# Altium schematic sheet AUX_M8_CONN_PWR_IN.SchDoc
size Tabloid; SheetNumber: 17; SheetTotal: 17
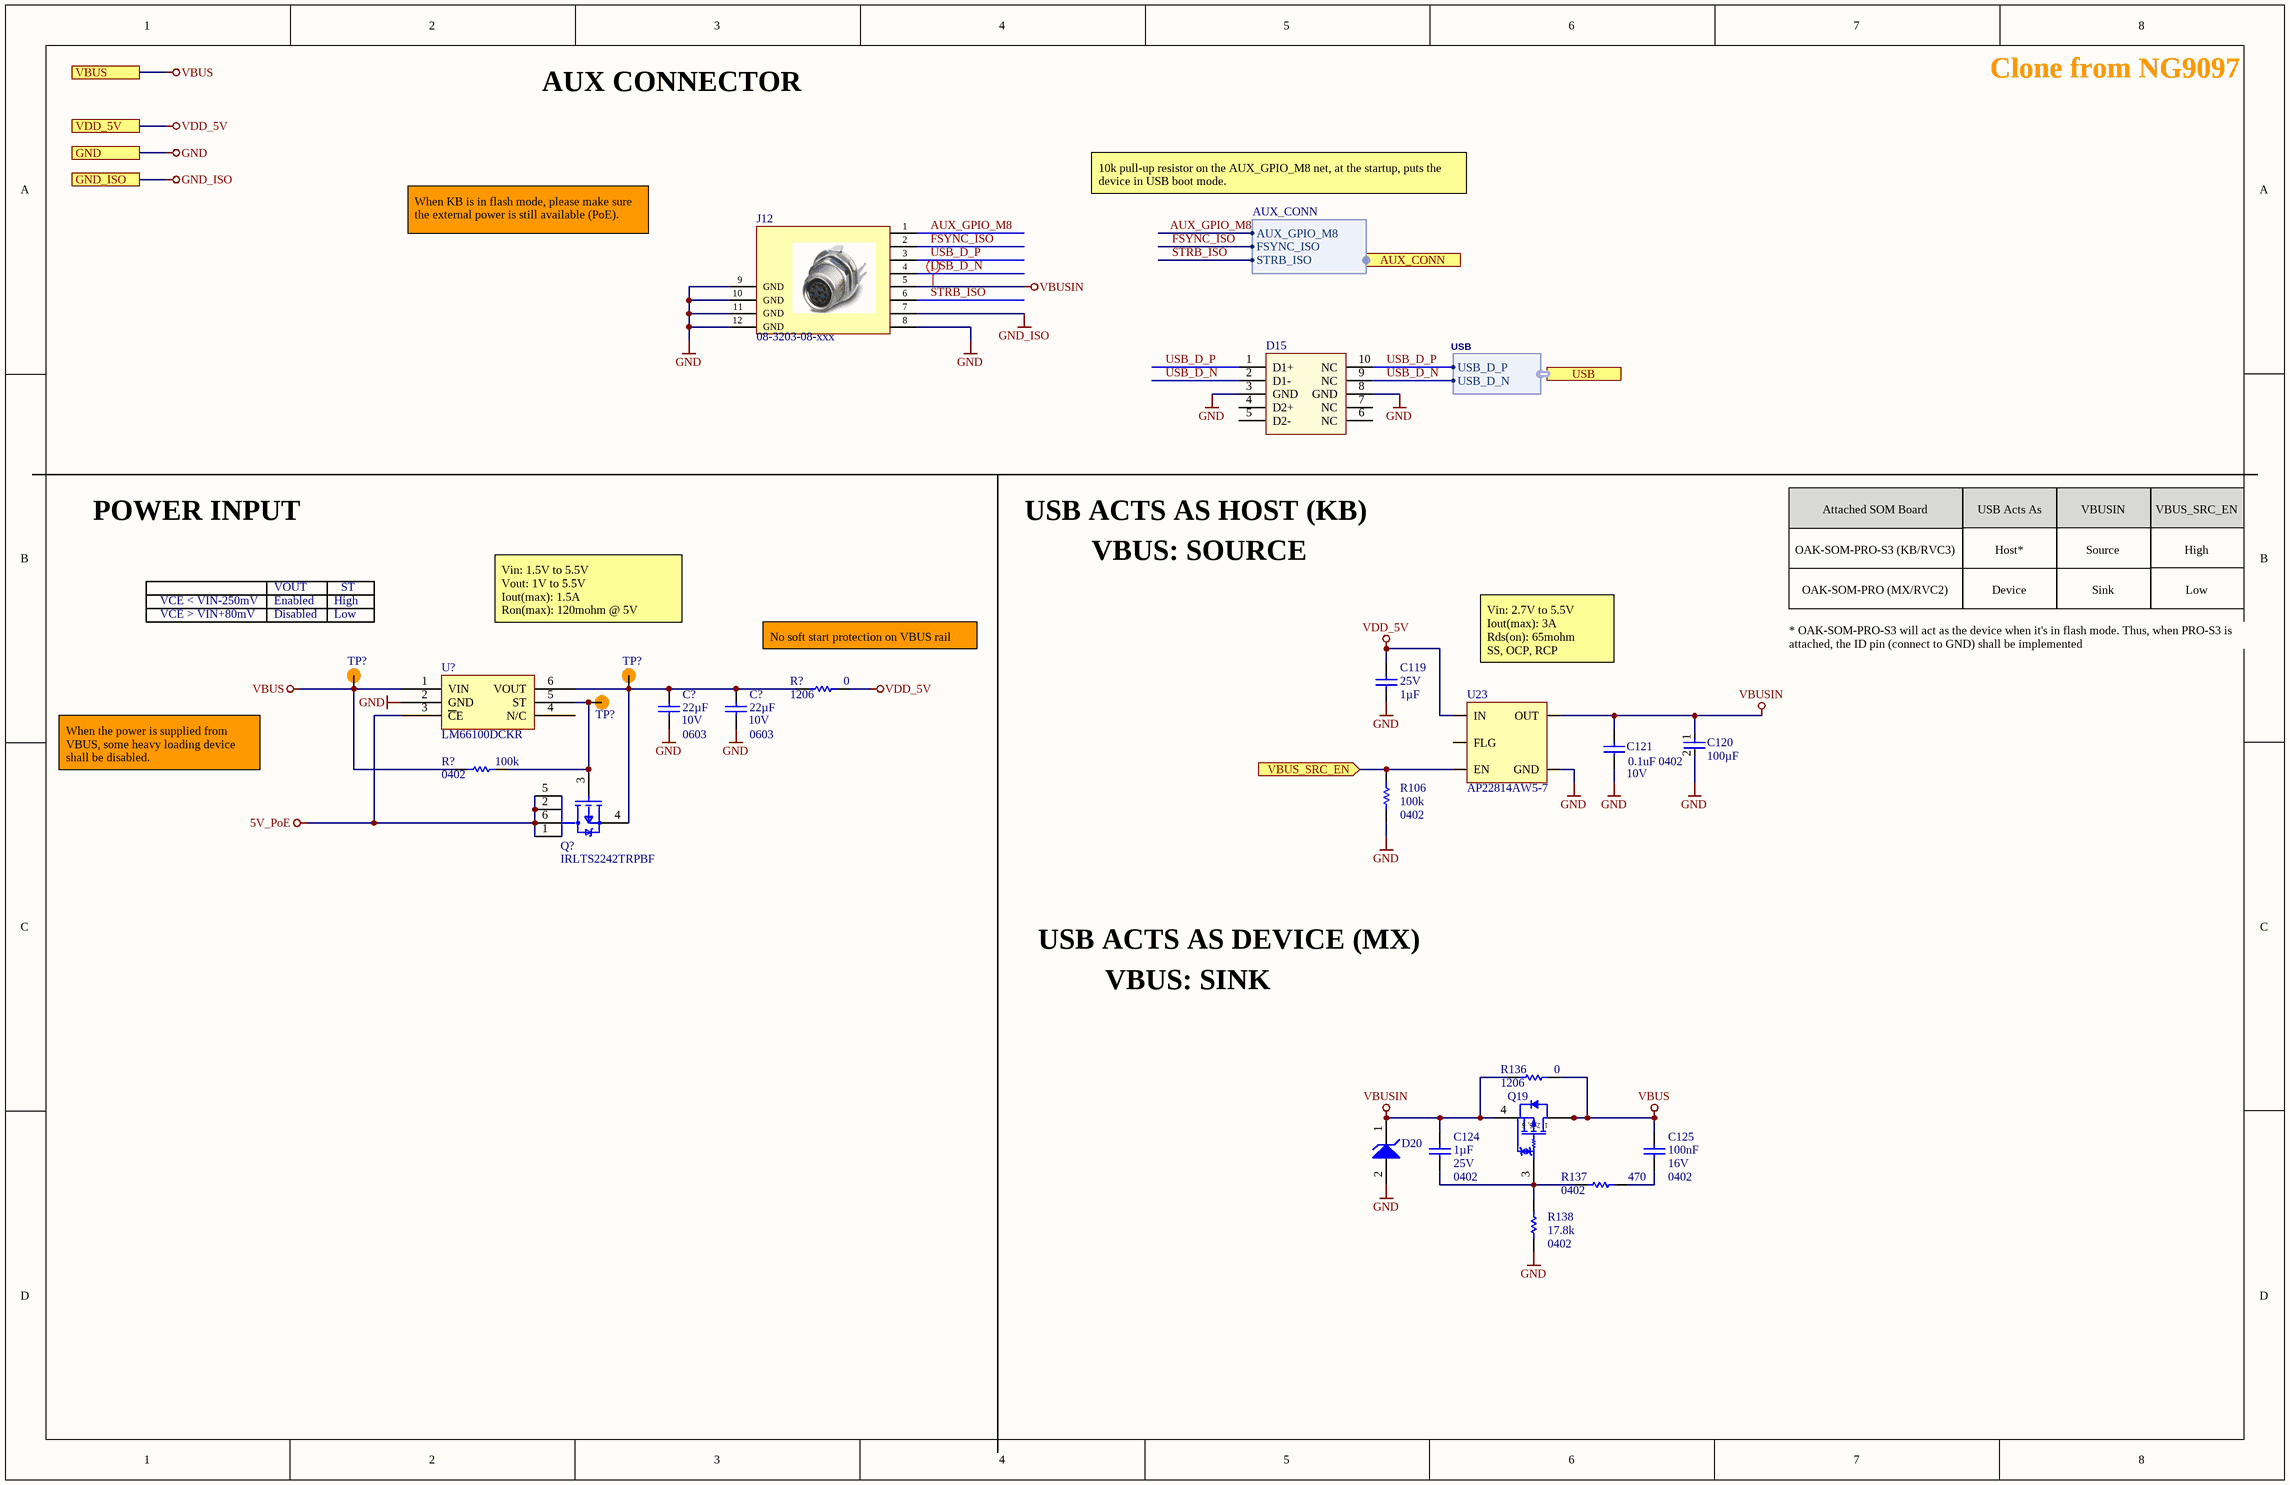
[diagram p0: AUX_M8_CONN_PWR_IN.SchDoc]

## Parts
(Parts that share a designator on the sheet are numbered #1, #2 ... from top to bottom, then left to right.)
C119  value 1µF  Voltage Rating: 25V  [CAPC0402(1005)70_N]  (hidden comment: GRM155R61E105KA12D)
C120  value 100µF  [FP-C1210C107M8PACTU-MFG]  (hidden comment: C1210C107M8PACTU)
C121  0.1uF 0402  Voltage Rating: 10V  [CAPC0402(1005)70_N]
C124  value 1µF  Voltage Rating: 25V  Case/Package: 0402  [CAPC0402(1005)70_N]  (hidden comment: GRM155R61E105KA12D)
C125  value 100nF  Voltage Rating: 16V  Case/Package: 0402  [CAPC0402(1005)60_N]  (hidden comment: CL05B104KO5NFNC)
C?#1  value 22µF  Voltage Rating: 10V  Case/Package: 0603  [CAPC0603(1608)100_N]  (hidden comment: GRM188R61A226ME15D)
C?#2  value 22µF  Voltage Rating: 10V  Case/Package: 0603  [CAPC0603(1608)100_N]  (hidden comment: GRM188R61A226ME15D)
D15  TPD4EUSB30DQAR  [TPD4EUSB30DQAR]  (value not drawn)
D20  SD05-01FTG  [FP-CDSOD323-TxxS-MFG]  (value not drawn)
J12  08-3203-08-xxx  [08-3203-08-XXX]
Q19  NTJS4151PT1G  [ONSC-SC70-6-419B-02_W_V]  (value not drawn)
Q?  IRLTS2242TRPBF  [TSOP-6-MFG]
R106  value 100k  Case/Package: 0402  [RESC0402(1005)_L]  (hidden comment: RC0402FR-07100KL)
R136  value 0  Case/Package: 1206  [RESC3116X70X50ML13T20]  (hidden comment: Resistor 0R +/- 0.05% 1206 250 mW)
R137  value 470  Case/Package: 0402  [RESC0402(1005)_L]  (hidden comment: CRCW0402470RFKED)
R138  value 17.8k  Case/Package: 0402  [RESC0402(1005)_L]  (hidden comment: ERJ-2RKF1782X)
R?#1  value 0  Case/Package: 1206  [RESC3116X70X50ML13T20]  (hidden comment: Resistor 0R +/- 0.05% 1206 250 mW)
R?#2  value 100k  Case/Package: 0402  [RESC0402(1005)_L]  (hidden comment: RC0402FR-07100KL)
TP?#1  TEST_POINT  [TP075_150_NS]  (value not drawn)  (no BOM)
TP?#2  TEST_POINT  [TP075_150_NS]  (value not drawn)  (no BOM)
TP?#3  TEST_POINT  [TP075_150_NS]  (value not drawn)  (no BOM)
U23  AP22814AW5-7  [AP22814AW5-7-Footprint-1]
U?  LM66100DCKR  [LM66100DCKR]

## Ports
AUX_CONN (harness AUX_CONN), GND, GND_ISO, USB (harness USB), VBUS, VBUS_SRC_EN (in), VDD_5V

## Harnesses
AUX_CONN: AUX_GPIO_M8, FSYNC_ISO, STRB_ISO
USB: USB_D_P, USB_D_N

## Nets
5V_PoE: Q?.1(D) Q?.2(D) Q?.5(D) Q?.6(D) U?.3(~{C}E)
GND: C119.1 C120.2 C121.1 C?#1.1 C?#2.1 D15.3(GND) D15.8(GND) D20.2(A) J12.8 J12.9(GND) J12.10(GND) J12.11(GND) J12.12(GND) R106.2 R138.1 U23.2(GND) U?.2(GND) ; port GND
GND_ISO: J12.7 ; port GND_ISO
VBUS: C125.2 Q19.1(D) Q19.2(D) Q19.5(D) Q19.6(D) R136.2 R?#2.2 TP?#1.1 U?.1(VIN) ; port VBUS
VBUSIN: C120.1 C121.2 C124.2 D20.1(K) J12.5 Q19.4(S) R136.1 U23.1(OUT)
VDD_5V: C119.2 R?#1.2 U23.5(IN) ; port VDD_5V
AUX_GPIO_M8: J12.1 ; port AUX_CONN.AUX_GPIO_M8
FSYNC_ISO: J12.2 ; port AUX_CONN.FSYNC_ISO
STRB_ISO: J12.6 ; port AUX_CONN.STRB_ISO
USB_D_N: D15.2(D1-) D15.9(NC) J12.4 ; port USB.USB_D_N
USB_D_P: D15.1(D1+) D15.10(NC) J12.3 ; port USB.USB_D_P
VBUS_SRC_EN: R106.1 U23.4(EN) ; port VBUS_SRC_EN
NetC124_1: C124.1 Q19.3(G) R137.1 R138.2
NetC125_1: C125.1 R137.2
NetC?#1_2: C?#1.2 C?#2.2 Q?.4(S) R?#1.1 TP?#2.1 U?.6(VOUT)
NetQ?_3: Q?.3(G) R?#2.1 TP?#3.1 U?.5(ST)

Not connected (* = marked no-connect by the designer): D15 4(D2+) 5(D2-) 6(NC) 7(NC); U23 3(FLG); U? 4(N/C)

## Layout directives
net class Power_trace: VBUSIN

## Notes on the sheet
- AUX CONNECTOR
- Clone from NG9097
- When KB is in flash mode, please make sure the external power is still available (PoE).
- 10k pull-up resistor on the AUX_GPIO_M8 net, at the startup, puts the device in USB boot mode.
- POWER INPUT
- USB ACTS AS HOST (KB)
- VBUS: SOURCE
- OAK-SOM-PRO-S3 (KB/RVC3)
- Attached SOM Board
- USB Acts As
- Host*
- VBUSIN
- Source
- VBUS_SRC_EN
- High
- VCE < VIN-250mV
- VCE > VIN+80mV
- Enabled
- Disabled
- VOUT
- Low
- ST
- Vin: 1.5V to 5.5V
  Vout: 1V to 5.5V
  Iout(max): 1.5A
  Ron(max): 120mohm @ 5V
- OAK-SOM-PRO (MX/RVC2)
- Device
- Sink
- No soft start protection on VBUS rail
- Vin: 2.7V to 5.5V
  Iout(max): 3A
  Rds(on): 65mohm
  SS, OCP, RCP
- * OAK-SOM-PRO-S3 will act as the device when it's in flash mode. Thus, when PRO-S3 is attached, the ID pin (connect to GND) shall be implemented
- When the power is supplied from VBUS, some heavy loading device shall be disabled.
- USB ACTS AS DEVICE (MX)
- VBUS: SINK
- Title
- Size:
- Date:
- A4
- Number:
- Time:
- Revision:
- Sheet
- of
- Luxonis Holding Corporation
- 7901 Shaffer Pkwy
- Littleton, CO
- 80127 USA
- File:
- (in symbol CMP-061-000004-1) 1, 2, 5, 6

## Library data of the parts
C119 C124 = CMP-108-000014-2: CAP CER 1UF 25V X5R 0402 10%; Manufacturer 1: Murata; ComponentLink2Description: https://datasheet.ciiva.com/7719/1666664-7719006.pdf?src-supplier=Element14; ComponentLink2URL: https://datasheet.ciiva.com/7719/1666664-7719006.pdf?src-supplier=Element14; Max Operating Temperature: 85°C; Depth: 0.5mm; Mounting Technology: SMT; ComponentLink1URL: https://datasheet.ciiva.com/22732/1666664-22732122.pdf?src-supplier=Element14; Length: 1mm; ComponentLink1Description: https://datasheet.ciiva.com/22732/1666664-22732122.pdf?src-supplier=Element14; Manufacturer Part Number 1: GRM155R61E105KA12D; Tolerance: 10%; Design Item ID: GRM155R61E105KA12D; Dielectric: X5R; Min Operating Temperature: -55°C; Height: 0.5mm; Width: 0.5mm
  C119: Case/Package: 0402
C120 = CMP-001-00121-2: Ceramic Capacitor, Multilayer, Ceramic, 10V, 20% +Tol, 20% -Tol, X5R, 15% TC, 100uF, Surface Mount, 1210; Manufacturer 1: Kemet; Manufacturer Part Number 1: C1210C107M8PACTU; Capacitor Type: Ceramic; Dielectric: X5R; Min Operating Temperature: -55°C; Case/Package: 1210; Voltage Rating: 10V; Max Operating Temperature: 85°C
C121 = GRM155R71A104JA01D: CAP CER 0.1UF 10V X7R 0402 5%; Manufacturer 1: Murata; Capacitance: 100nF; Supplier 1: Digi-Key; Manufacturer Part Number 1: GRM155R71A104JA01D; Stock 1: 1346709; Pricing 1: 1=0.10000, 10=0.02500, 100=0.01130, 500=0.00806, 1000=0.00633, 2500=0.00575, 5000=0.00529 (USD); RoHS: Yes; Mount: Surface Mount; Case/Package: 0402; Case Code (Imperial): 0402; Case Code (Metric): 1005; Min Operating Temperature: -55°C; Max Operating Temperature: 125°C; Tolerance: 5%; Packaging: Tape and Reel; Voltage Rating (DC): 10V; Dielectric: X7R; Package Quantity: 10000; Termination: SMD/SMT; Length: 1mm; Height: 0.5mm; Width: 0.02inch; Thickness: 0.022inch; Depth: 0.5mm; Radiation Hardening: No; Lead Free: Lead Free; ComponentLink1URL: https://datasheet.ciiva.com/5411/product-5411135.pdf?src-supplier=Mouser; ComponentLink1Description: https://datasheet.ciiva.com/5411/product-5411135.pdf?src-supplier=Mouser; ComponentLink2URL: https://datasheet.ciiva.com/11618/c02e-11618821.pdf?src-supplier=Avnet; ComponentLink2Description: https://datasheet.ciiva.com/11618/c02e-11618821.pdf?src-supplier=Avnet; Supplier Part Number 1: 490-10777-1-ND
C125 = CMP-108-000002-2: CAP CER 0.1UF 16V X7R 0402; Manufacturer 1: Samsung; Tolerance: 10%; ComponentLink1URL: https://datasheet.ciiva.com/25767/cl05b104ko5nfnc-25767124.pdf?src-supplier=Digi-Key; Length: 1mm; Design Item ID: CL05B104KO5NFNC; Min Operating Temperature: -55°C; Width: 0.02inch; Dielectric: X7R; ComponentLink1Description: https://datasheet.ciiva.com/25767/cl05b104ko5nfnc-25767124.pdf?src-supplier=Digi-Key; Height: 0.5mm; Depth: 0.5mm; Manufacturer Part Number 1: CL05B104KO5NFNC; Max Operating Temperature: 125°C; Mounting Technology: SMT
C?#1 C?#2 = CMP-108-000020-2: CAP CER 22UF 10V X5R 0603 20%; Manufacturer 1: Murata; Tolerance: 20%; Max Operating Temperature: 85°C; ComponentLink1Description: https://datasheet.ciiva.com/46444/1769893-46444975.pdf?src-supplier=Element14; Min Operating Temperature: -55°C; Manufacturer Part Number 1: GRM188R61A226ME15D; Mounting Technology: SMT; Depth: 0.8mm; Design Item ID: GRM188R61A226ME15D; Height: 0.8mm; Dielectric: X5R; Width: 0.8mm; Length: 1.6mm; ComponentLink1URL: https://datasheet.ciiva.com/46444/1769893-46444975.pdf?src-supplier=Element14
D15 = CMP-008-000011-2: TVS DIODE 5.5V 8V 10SON 8V Clamp 1A (8/20µs) Ipp Tvs Diode Surface Mount 10-USON (2.5x1); Manufacturer 1: Texas Instruments; Forward Current: 5A; Manufacturer Part Number 1: TPD4EUSB30DQAR; Min Operating Temperature: -40°C; Max Operating Temperature: 85°C; Clamping Voltage: 8V
D20 = SD05-01FTG: Trans Voltage Suppressor Diode, 450W, 5V V(RWM), Unidirectional, 1 Element, Silicon; Manufacturer 1: Littelfuse; Package Body Material: Plastic; Number of Elements: 1; Time @ Peak Reflow Temperature-Max (s): 40s; Supplier 1: Digi-Key; RoHS: Yes; Category: TVS Diodes; Number of Pins: 2; Diode Element Material: SILICON; Package Shape: Rectangular; Terminal Finish: Tin; Min Operating Temperature: -40°C; Max Operating Temperature: 125°C; JESD-609 Code: e3; Polarity: Unidirectional; Diode Type: TRANS VOLTAGE SUPPRESSOR; JESD-30 Code: R-PDSO-G2; Non-rep Peak Rev Power Dis-Max: 450W; Package Style: SMALL OUTLINEMeter; Peak Reflow Temperature (Cel): 260°C; Rep Pk Reverse Voltage-Max: 5V; Surface Mount: Yes; Technology: AVALANCHE; Terminal Form: Gull Wing; Terminal Position: DUAL; REACH SVHC: No SVHC; RoHS Compliant: Yes; ComponentLink1URL: https://datasheet.ciiva.com:443/pdfs/VipMasterIC/IC/LFSI/LFSI-S-A0009026845/LFSI-S-A0009026845-1.pdf?src-supplier=IHS+Markit; ComponentLink1Description: https://datasheet.ciiva.com:443/pdfs/VipMasterIC/IC/LFSI/LFSI-S-A0009026845/LFSI-S-A0009026845-1.pdf?src-supplier=IHS+Markit; ComponentLink2URL: https://datasheet.ciiva.com/13083/littelfuse-tvs-diode-array-sd05-13083440.pdf?src-supplier=Mouser; ComponentLink2Description: https://datasheet.ciiva.com/13083/littelfuse-tvs-diode-array-sd05-13083440.pdf?src-supplier=Mouser; ComponentLink3URL: https://datasheet.ciiva.com/22643/littelfuse-tvs-diode-array-sd05-datasheet-22643616.pdf?src-supplier=Element14; ComponentLink3Description: https://datasheet.ciiva.com/22643/littelfuse-tvs-diode-array-sd05-datasheet-22643616.pdf?src-supplier=Element14; ComponentLink4URL: https://datasheet.ciiva.com/18551/littelfuse-tvs-diode-array-sd05-datasheet-18551556.pdf?src-supplier=Digi-Key; ComponentLink4Description: https://datasheet.ciiva.com/18551/littelfuse-tvs-diode-array-sd05-datasheet-18551556.pdf?src-supplier=Digi-Key; ComponentLink5URL: https://datasheet.ciiva.com/18551/littelfuse-tvs-diode-array-sd-datasheet-pdf-18551557.pdf?src-supplier=Digi-Key; ComponentLink5Description: https://datasheet.ciiva.com/18551/littelfuse-tvs-diode-array-sd-datasheet-pdf-18551557.pdf?src-supplier=Digi-Key; ComponentLink6URL: https://datasheet.ciiva.com/18551/littelfuse-tvs-diode-array-sd-datasheet-pdf-18551558.pdf?src-supplier=Digi-Key; ComponentLink6Description: https://datasheet.ciiva.com/18551/littelfuse-tvs-diode-array-sd-datasheet-pdf-18551558.pdf?src-supplier=Digi-Key; Supplier Part Number 1: F6190CT-ND; Manufacturer Part Number 1: SD05-01FTG; Stock 1: 9404; Pricing 1: 1=0,43000, 10=0,35200, 100=0,23940, 500=0,17952, 1000=0,13464 (USD)
J12 = CMP-002-00116-2: M8 Circular Connector; Manufacturer 1: KingTop; RoHS: Yes; Category: Circular Connectors; Contact Finish - Mating: NOT SPECIFIED; Connector Type: Circular; REACH SVHC: No SVHC; RoHS Compliant: Yes; ComponentLink1URL: https://datasheet.ciiva.com:443/pdfs/VipMasterIC/IC/PCON/PCON-S-A0001961096/PCON-S-A0001960825-1.pdf?src-supplier=IHS+Markit; ComponentLink1Description: https://datasheet.ciiva.com:443/pdfs/VipMasterIC/IC/PCON/PCON-S-A0001961096/PCON-S-A0001960825-1.pdf?src-supplier=IHS+Markit; ComponentLink2URL: https://datasheet.ciiva.com/29221/1456132-29221494.pdf?src-supplier=Digi-Key; ComponentLink2Description: https://datasheet.ciiva.com/29221/1456132-29221494.pdf?src-supplier=Digi-Key; ComponentLink3URL: https://datasheet.ciiva.com/41451/718258-da-01-de-sens-akt-einbaubuch-6pol-1456132-20-st-41451463.pdf?src-supplier=Conrad; ComponentLink3Description: https://datasheet.ciiva.com/41451/718258-da-01-de-sens-akt-einbaubuch-6pol-1456132-20-st-41451463.pdf?src-supplier=Conrad; Manufacturer Part Number 1: 08-3203-08-XXX; Stock 1: 11; Pricing 1: 1=26,56000, 10=24,43500, 50=22,57600, 100=21,51360, 250=20,18568 (USD); Design Item ID: 08-3203-08-xxx; Source: NG9097.SchLib; Pins: 8
Q19 = CMP-061-000004-1: Trench Power MOSFET, -20 V, -4.2 A, Single P-Channel, 6-Pin SC70, Pb-Free, Tape and Reel; Manufacturer 1: ON Semiconductor; VGS(th) Max (V): 1.2; VGS Max (V): 12; Crss Typ (pF): 110; Ciss Typ (pF): 850; PD Max (W): 1; Qrr Typ (nC): 0.23; ID Max (A): 4.2; Coss Typ (pF): 160; Channel Polarity: P Channel; V(BR)DSS Min (V): 20; Mounting Technology: Surface Mount; ComponentLink3Description: Package Specification; Packing: Tape and Reel; DatasheetVersion: Rev. 1; RoHS: Pb-Free; Configuration: Single; PackageReference: SC70-6-419B-02_W; PackageVersion: Rev. W; Package Type: SC-88-6 / SC-70-6 / SOT-363-6; ComponentLink3URL: http://www.onsemi.com/pub_link/Collateral/SMF05C-D.PDF; PackageDescription: 6-Pin Small Outline Transistor, Body 2 x 1.25 mm, Pitch 0.65 mm; PartNumber: NTJS4151PT1G; ComponentLink2Description: Datasheet; ComponentLink1Description: Manufacturer URL; ComponentLink2URL: http://www.onsemi.com/pub_link/Collateral/NTJS4151P-D.PDF; ComponentLink1URL: http://www.onsemi.com/; Manufacturer Part Number 1: NTJS4151PT1G; Component Type: Standard; Design Item ID: NTJS4151PT1G; Pin Count: 6; Source: DM9095_R3M2E4.SCHLIB
Q? = CMP-016-000020-1: MOSFET P-CH 20V 6.9A 6TSOP; Manufacturer 1: Infineon; Drain to Source Voltage (Vdss): -20V; Rise Time: 18ns; Max Power Dissipation: 2W; Gate to Source Voltage (Vgs): 12V; Input Capacitance: 905pF; Rds On Max: 32mR; Threshold Voltage: -400mV; Mount: Surface Mount; Min Operating Temperature: -55°C; Source: LuxonisMaster.SchLib; Halogen Free: Halogen Free; Lead Free: Lead Free; Contact Plating: Tin; Case/Package: TSOP; Number of Pins: 6; Manufacturer Part Number 1: IRLTS2242TRPBF; Design Item ID: IRLTS2242TRPBF; Max Operating Temperature: 150°C; Packaging: Tape and Reel; Continuous Drain Current (ID): 6.9A; REACH SVHC: No SVHC; Max Dual Supply Voltage: -20V; RoHS Compliant: Yes
R106 R?#2 = CMP-013-000035-8: RES SMD 100K OHM 1% 1/16W 0402; Manufacturer 1: Yageo; Power Rating: 63mW; Voltage Rating: 50V; Tolerance: 1%; Min Operating Temperature: -55°C; Max Operating Temperature: 155°C; Design Item ID: RC0402FR-07100KL; Manufacturer Part Number 1: RC0402FR-07100KL
R136 R?#1 = CMP-009-00008-12: Chip Resistor, 0 Ohm, 0.25 W, -55 to 155 degC, 1206 (3216 Metric); Manufacturer Part Number 1: REPLACE RESISTOR; Power Rating: 250mW; Voltage Rating: 200V; Max Operating Temperature: 155°C; Tolerance: 0.05%; Min Operating Temperature: -55°C
R137 = CMP-013-000029-9: RES SMD 470 OHM 1% 1/16W 0402; Manufacturer 1: Vishay; Voltage Rating: 50V; Power Rating: 63mW; Max Operating Temperature: 155°C; Min Operating Temperature: -55°C; Tolerance: 1%; Design Item ID: CRCW0402470RFKED; Manufacturer Part Number 1: CRCW0402470RFKED
R138 = CMP-013-000001-9: RES SMD 17.8K OHM 1% 1/10W 0402; Manufacturer 1: Panasonic; Power Rating: 100mW; Voltage Rating: 50V; Design Item ID: ERJ-2RKF1782X; Tolerance: 1%; Max Operating Temperature: 155°C; Manufacturer Part Number 1: ERJ-2RKF1782X; Min Operating Temperature: -55°C
TP?#1-TP?#3 = CMP-015-000000-2: Manufacturer Part Number 1: /; Source: LuxonisMaster.SchLib; Design Item ID: TEST_POINT
U23 = CMP-019-00050-2: Single Channel Power Distribution Load Switch, -40 to 85°C, Rohs; Manufacturer 1: Diodes Incorporated; Vfb/Vout: 0V; Max Output Current: 0A; Manufacturer Part Number 1: AP22814AW5-7; Case/Package: SOT-25
U? = CMP-099-000001-1: IC OR CTRLR IDEAL DIODE SC70-6; Manufacturer 1: Texas Instruments; RoHS: No; Pricing 1: 1=0.41000, 10=0.32900, 25=0.30120, 100=0.20300, 250=0.16800, 500=0.15400, 1000=0.11550 (USD); Stock 1: 8042; Design Item ID: LM66100DCKR; Source: NG2391C-HM.SchLib; Category: Integrated Circuits (ICs); Manufacturer Part Number 1: LM66100DCKR